# EAGLE schematic HeartBeatAuditoryFeedbackV1 (EAGLE 7.7.0)
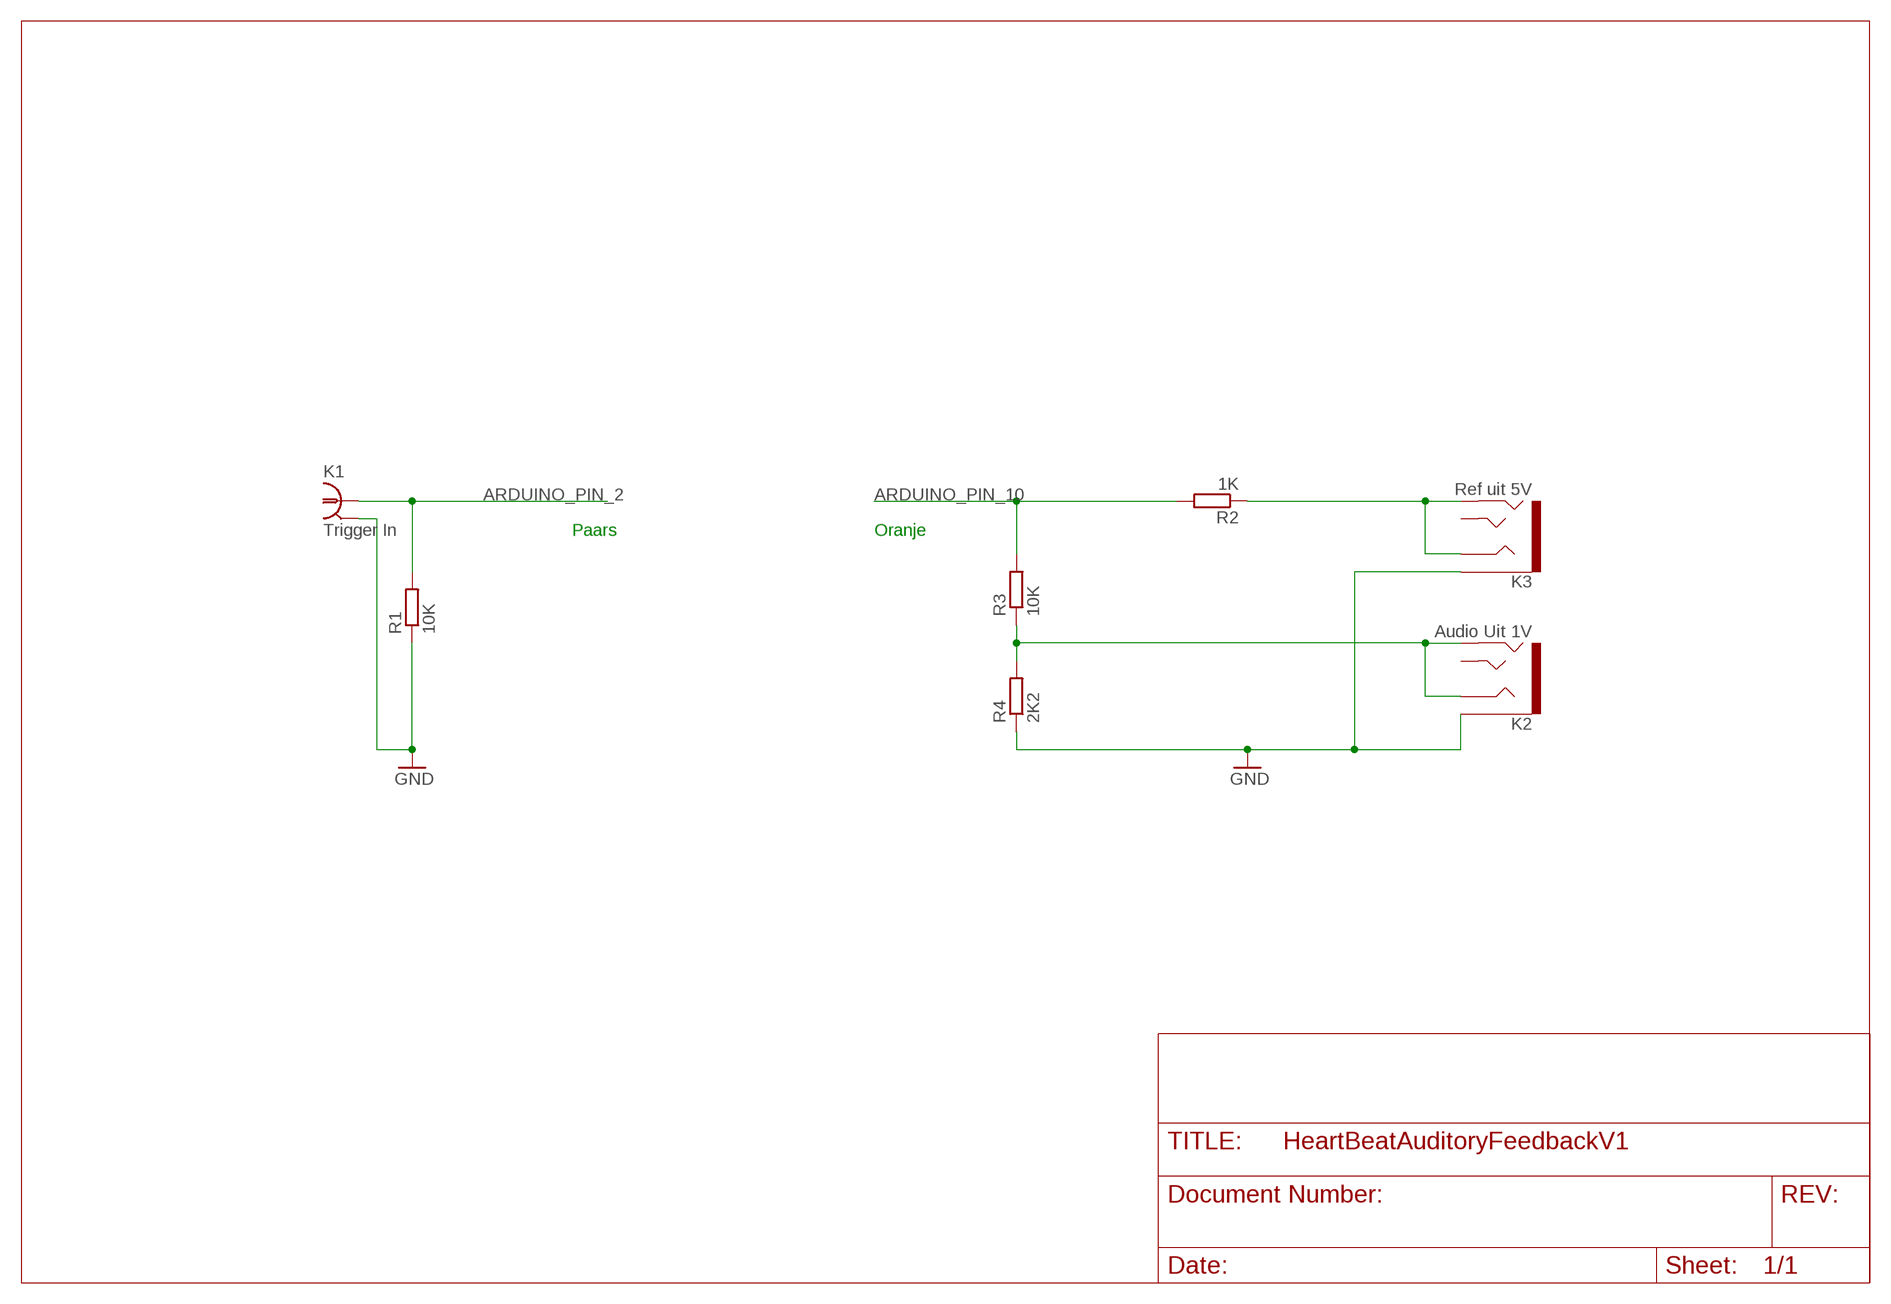
[diagram p0: schematic, sheet 1]

## Parts
K1  Trigger In  BN35N61  [B35N61]
K2  Audio Uit 1V  AUDIO_JACK_TRRSSMD_RA  [AUDIO_JACK_3.5MM_TRRS_SMD_RA]
K3  Ref uit 5V  AUDIO_JACK_TRRSSMD_RA  [AUDIO_JACK_3.5MM_TRRS_SMD_RA]
R1  10K  R-EU_0204/7  [0204/7]
R2  1K  R-EU_0204/7  [0204/7]
R3  10K  R-EU_0204/7  [0204/7]
R4  2K2  R-EU_0204/7  [0204/7]

## Nets
ARDUINO_PIN_2: K1.1 R1.2
ARDUINO_PIN_10: R2.2 R3.2
GND: K1.2 K1.3 K1.4 K1.5 K2.EARTH K3.EARTH R1.1 R4.1
N$1: K2.RING1 K2.RING2 R3.1 R4.2
N$2: K3.RING1 K3.RING2 R2.1
Unconnected: K2.TIP K3.TIP

## Notes on the sheet
- Paars | Oranje

## Library data of the parts
K1 = con-coax:BN35N61: BNC CONNECTOR M/A COM www.macom.com distributor Farnell 149-452; OC_FARNELL: unknown; OC_NEWARK: unknown
K2 K3 = SparkFun-Connectors:AUDIO_JACK_TRRS: Audio Jack - 3.5mm TRRS (SMD) This is a 3.5mm TRRS SMD audio jack. TRRS connectors are the audio-style connectors that you see on some phones, MP3 players and development boards. TRRS stands for “tip, ring, ring, sleeve,” which reflects that this has three conductors and a ground. SparkFun Products: Audio Jack <https://www.sparkfun.com/products/12639> mbed Starter Kit <https://www.sparkfun.com/products/12968> SparkFun TRRS 3.5mm Jack Breakout <https://www.sparkfun.com/products/11570>; PROD_ID: CONN-10676; SF_ID: PRT-12639
R1-R4 = rcl:R-EU_: RESISTOR, European symbol